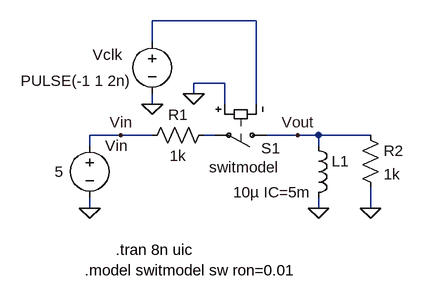
[diagram p0: schematic Fig1_31.asc]
Fig1_31.asc, the LTspice schematic file:
Version 4
SHEET 1 1048 680
WIRE 256 48 96 48
WIRE 96 80 96 48
WIRE 208 144 160 144
WIRE 160 160 160 144
WIRE 96 176 96 160
WIRE 208 176 208 144
WIRE 256 176 256 48
WIRE 48 224 0 224
WIRE 96 224 48 224
WIRE 192 224 176 224
WIRE 320 224 272 224
WIRE 352 224 320 224
WIRE 432 224 352 224
WIRE 0 240 0 224
WIRE 352 240 352 224
WIRE 0 336 0 320
WIRE 352 336 352 320
WIRE 432 336 432 304
FLAG 0 336 0
FLAG 432 336 0
FLAG 320 224 Vout
FLAG 48 224 Vin
FLAG 160 160 0
FLAG 96 176 0
FLAG 352 336 0
SYMBOL voltage 0 224 R0
WINDOW 123 0 0 Left 0
WINDOW 39 0 0 Left 0
WINDOW 3 -54 56 Left 0
SYMATTR Value 5
SYMATTR InstName Vin
SYMBOL res 80 240 R270
WINDOW 0 32 56 VTop 0
WINDOW 3 0 56 VBottom 0
SYMATTR InstName R1
SYMATTR Value 1k
SYMBOL sw 288 224 R90
WINDOW 0 20 -5 VRight 0
WINDOW 3 49 -3 VRight 0
SYMATTR InstName S1
SYMATTR Value switmodel
SYMBOL voltage 96 64 R0
WINDOW 0 -91 36 Left 0
WINDOW 3 -202 76 Left 0
WINDOW 123 0 0 Left 0
WINDOW 39 0 0 Left 0
SYMATTR InstName Vclk
SYMATTR Value PULSE(-1 1 2n)
SYMBOL res 416 208 R0
SYMATTR InstName R2
SYMATTR Value 1k
SYMBOL ind 336 224 R0
WINDOW 3 -115 88 Left 0
SYMATTR InstName L1
SYMATTR Value 10µ IC=5m
TEXT 40 400 Left 0 !.tran 8n uic
TEXT -8 432 Left 0 !.model switmodel sw ron=0.01

The netlist it stands for:
* Fig1_31.asc
Vin Vin 0 5
R1 Vin N002 1k
S1 Vout N002 0 N001 switmodel
Vclk N001 0 PULSE(-1 1 2n)
R2 Vout 0 1k
L1 Vout 0 10µ IC=5m
.tran 8n uic
.model switmodel sw ron=0.01
.backanno
.end